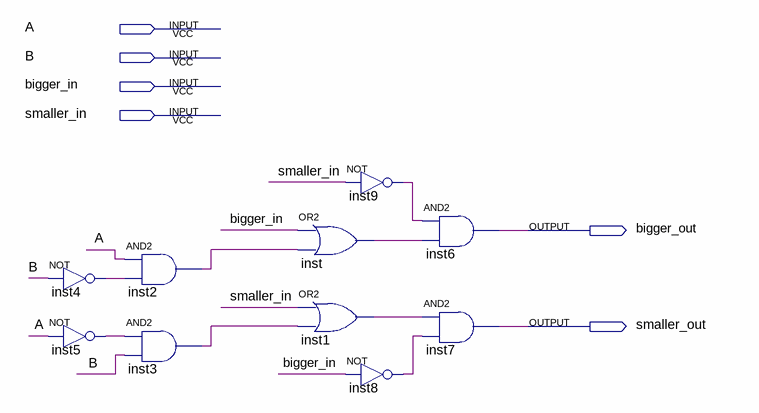
[diagram p0: schematic sheet]
// Quartus schematic Compare.bdf as structural Verilog: 10 symbols, 6 pins
module Compare (
  input  A,
  input  B,
  input  bigger_in,
  input  smaller_in,
  output bigger_out,
  output smaller_out
);

  wire inst1_out, inst2_out, inst3_out, inst4_out, inst5_out, inst8_out, inst9_out, inst_out;

  not inst4 (inst4_out, B);
  not inst5 (inst5_out, A);
  and inst2 (inst2_out, A, inst4_out);
  and inst3 (inst3_out, inst5_out, B);
  or inst (inst_out, bigger_in, inst2_out);
  or inst1 (inst1_out, smaller_in, inst3_out);
  not inst9 (inst9_out, smaller_in);
  not inst8 (inst8_out, bigger_in);
  and inst6 (bigger_out, inst9_out, inst_out);
  and inst7 (smaller_out, inst1_out, inst8_out);
endmodule
